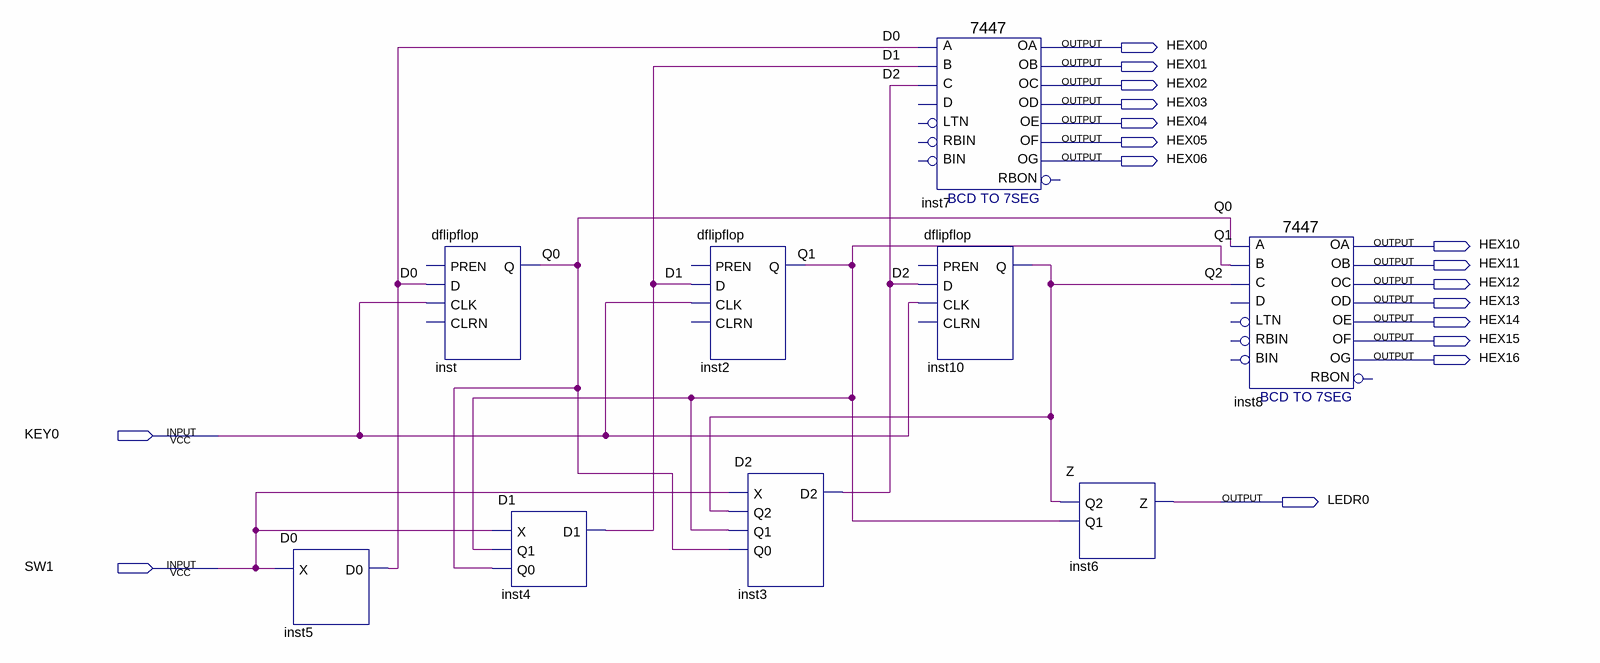
[diagram p0: schematic sheet]
// Quartus schematic LAB02MOORE.bdf as structural Verilog: 9 symbols, 17 pins
module LAB02MOORE (
  input  KEY0,
  input  SW1,
  output HEX00,
  output HEX01,
  output HEX02,
  output HEX03,
  output HEX04,
  output HEX05,
  output HEX06,
  output HEX10,
  output HEX11,
  output HEX12,
  output HEX13,
  output HEX14,
  output HEX15,
  output HEX16,
  output LEDR0
);

  wire D0, D1, D2, Q0, Q1, Q2;

  D0 inst5 (.X(SW1), .D0(D0));
  dflipflop inst (.D(D0), .CLK(KEY0), .Q(Q0));  // open: PREN, CLRN
  D1 inst4 (.X(SW1), .Q1(Q1), .Q0(Q0), .D1(D1));
  dflipflop inst2 (.D(D1), .CLK(KEY0), .Q(Q1));  // open: PREN, CLRN
  D2 inst3 (.X(SW1), .Q2(Q2), .Q1(Q1), .Q0(Q0), .D2(D2));
  \7447  inst7 (
    .B(D1), .C(D2), .A(D0), .OB(HEX01), .OC(HEX02), .OE(HEX04), .OD(HEX03), .OF(HEX05), .OG(HEX06), .OA(HEX00));  // open: LTN, D, RBIN, BIN, RBON
  dflipflop inst10 (.D(D2), .CLK(KEY0), .Q(Q2));  // open: PREN, CLRN
  Z inst6 (.Q2(Q2), .Q1(Q1), .Z(LEDR0));
  \7447  inst8 (
    .B(Q1), .C(Q2), .A(Q0), .OB(HEX11), .OC(HEX12), .OE(HEX14), .OD(HEX13), .OF(HEX15), .OG(HEX16), .OA(HEX10));  // open: LTN, D, RBIN, BIN, RBON
endmodule
